# Altium schematic sheet dental-uint-chair_control v1_1.SchDoc
size 840 x 594 mm
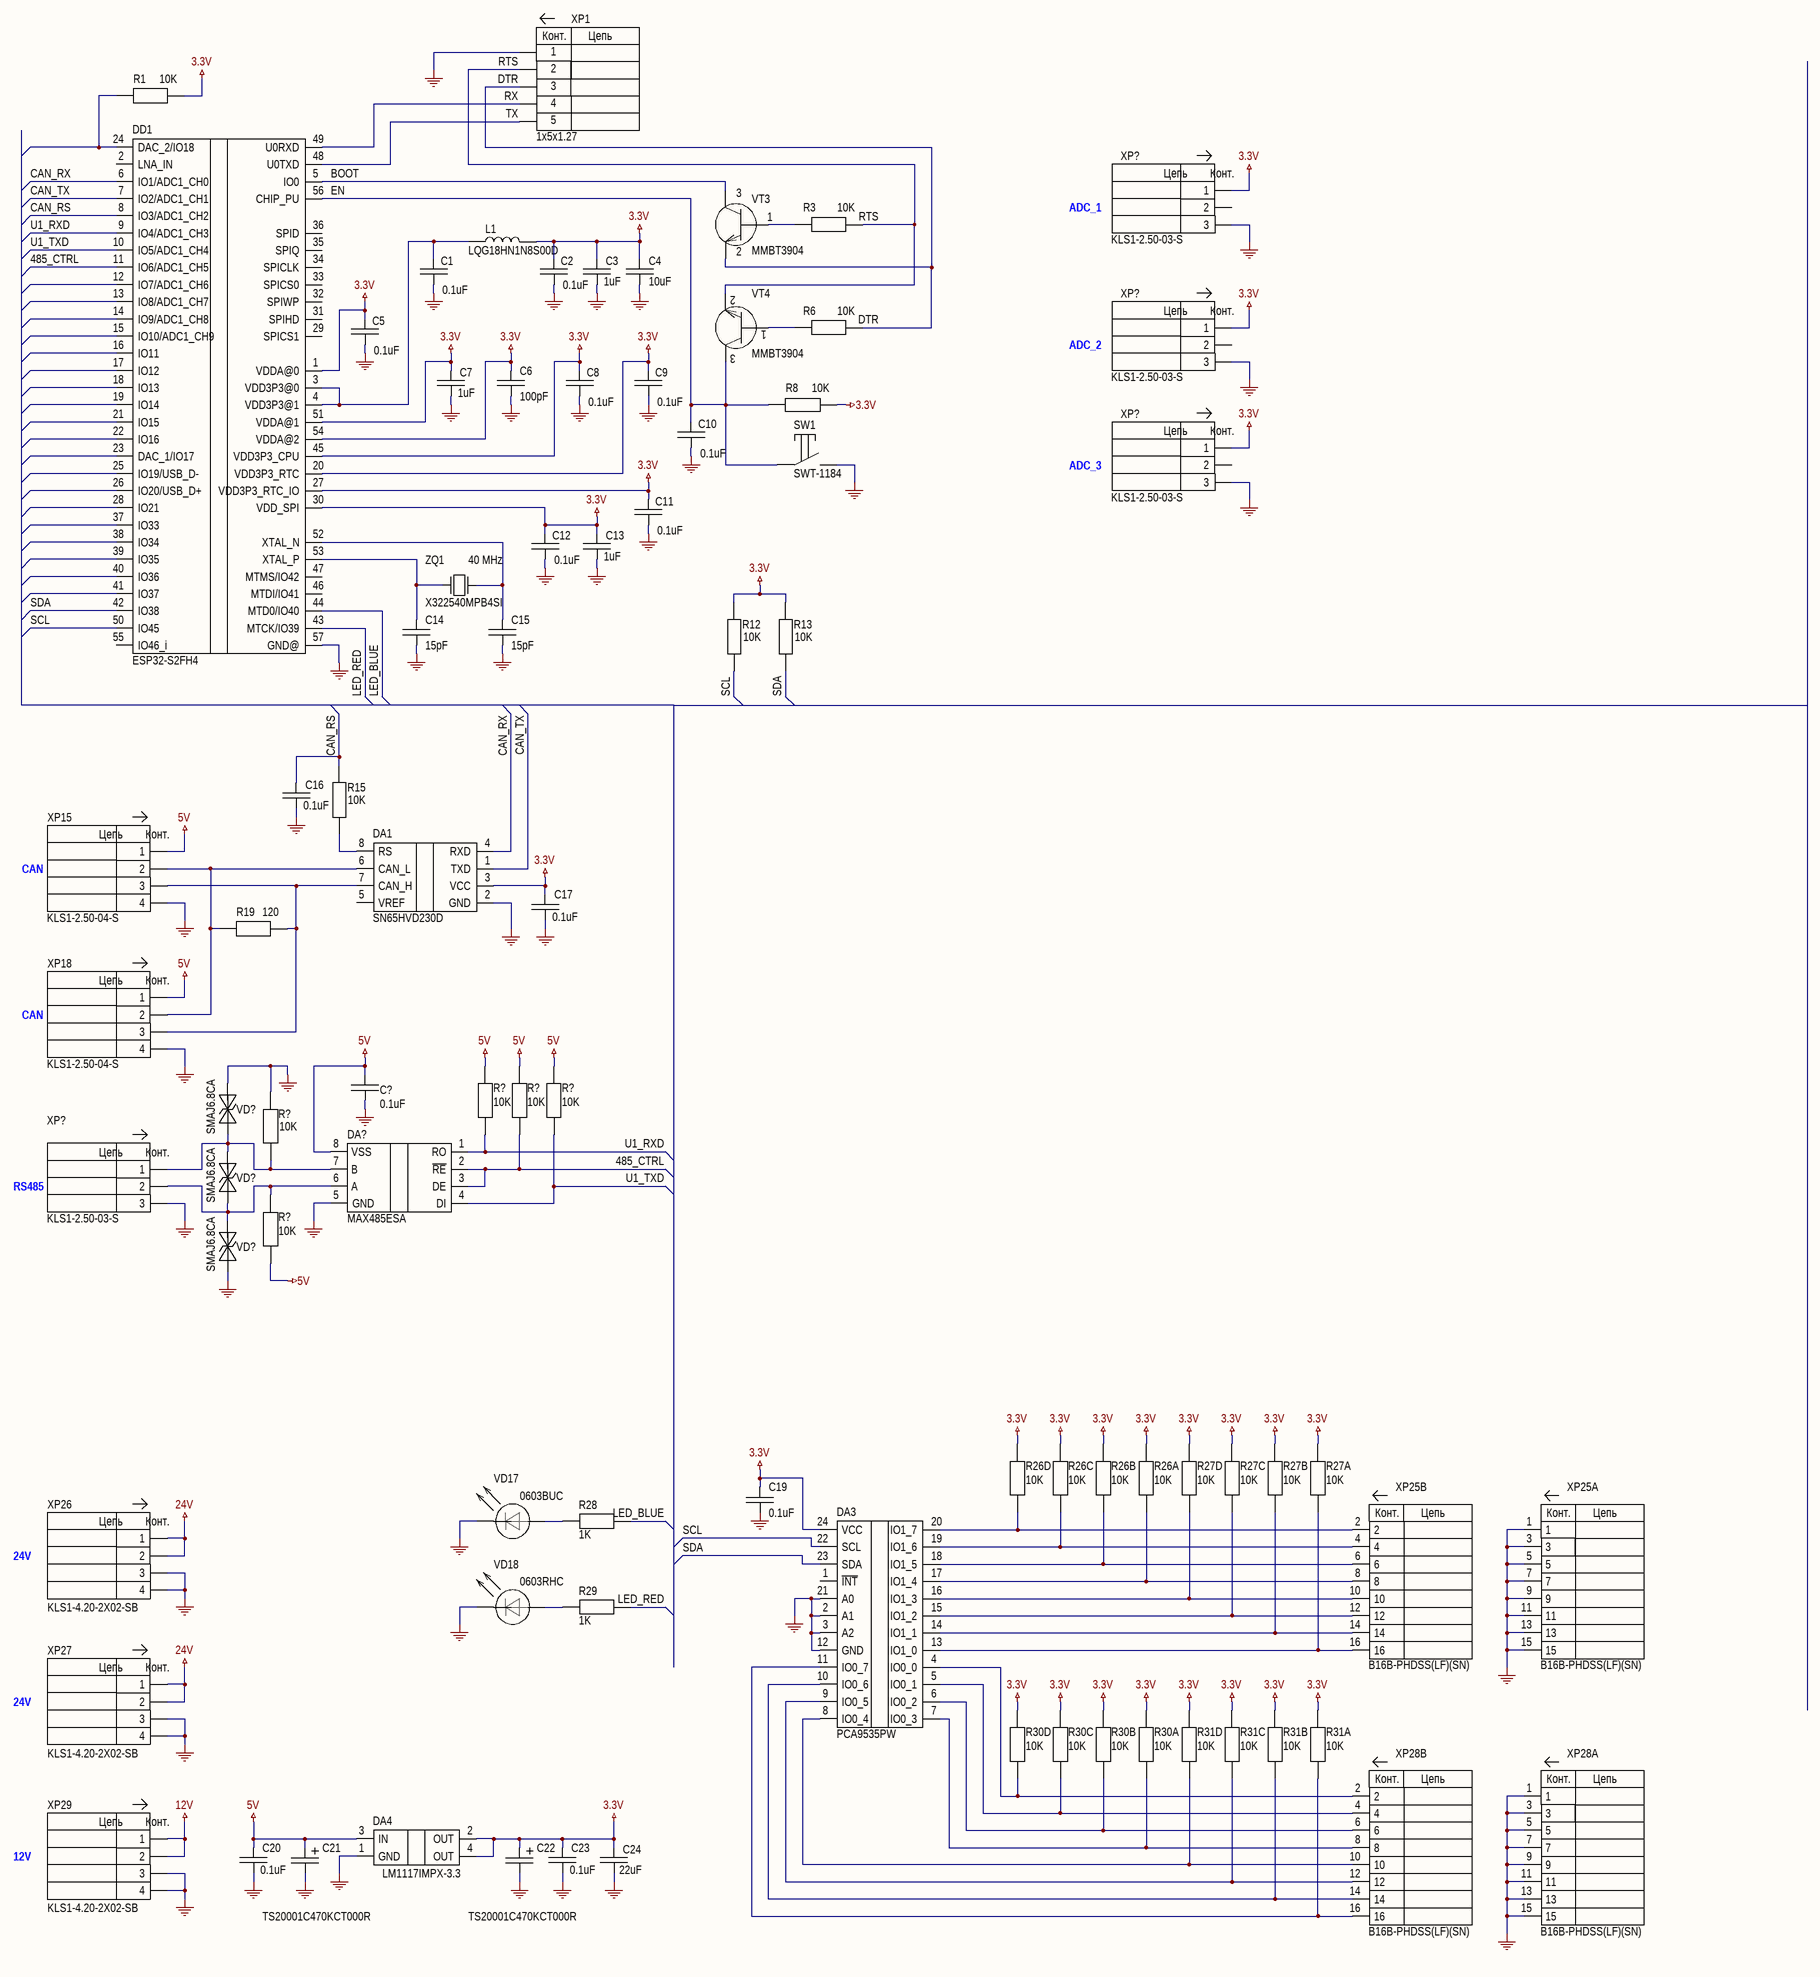
[diagram p0: dental-uint-chair_control v1_1.SchDoc]

## Parts
(Parts that share a designator on the sheet are numbered #1, #2 ... from top to bottom, then left to right.)
C1  value 0.1uF  [CC_0603]  (hidden comment: CC0603KRX7R5BB104)
C2  value 0.1uF  [CC_0603]  (hidden comment: CC0603KRX7R5BB104)
C3  value 1uF  [CC_0603]  (hidden comment: CL10A105KB8NNNC)
C4  value 10uF  [CC_0603]  (hidden comment: CL10A106KP8NNNC)
C5  value 0.1uF  [CC_0603]  (hidden comment: CC0603KRX7R5BB104)
C6  value 100pF  [CC_0603]  (hidden comment: CC0603FRNPO9BN101)
C7  value 1uF  [CC_0603]  (hidden comment: CL10A105KB8NNNC)
C8  value 0.1uF  [CC_0603]  (hidden comment: CC0603KRX7R5BB104)
C9  value 0.1uF  [CC_0603]  (hidden comment: CC0603KRX7R5BB104)
C10  value 0.1uF  [CC_0603]  (hidden comment: CC0603KRX7R5BB104)
C11  value 0.1uF  [CC_0603]  (hidden comment: CC0603KRX7R5BB104)
C12  value 0.1uF  [CC_0603]  (hidden comment: CC0603KRX7R5BB104)
C13  value 1uF  [CC_0603]  (hidden comment: CL10A105KB8NNNC)
C14  value 15pF  [CC_0603]  (hidden comment: CC0603GPNPO9BN150)
C15  value 15pF  [CC_0603]  (hidden comment: CC0603GPNPO9BN150)
C16  value 0.1uF  [CC_0603]  (hidden comment: CC0603KRX7R5BB104)
C17  value 0.1uF  [CC_0603]  (hidden comment: CC0603KRX7R5BB104)
C19  value 0.1uF  [CC_0603]  (hidden comment: CC0603KRX7R5BB104)
C20  value 0.1uF  [CC_0603]  (hidden comment: CC0603KRX7R5BB104)
C21  TS20001C470KCT000R  [CC_TANT_C]
C22  TS20001C470KCT000R  [CC_TANT_C]
C23  value 0.1uF  [CC_0603]  (hidden comment: CC0603KRX7R5BB104)
C24  value 22uF  [CC_0805]  (hidden comment: GRM21BR60J226ME39L)
C?  value 0.1uF  [CC_0603]  (hidden comment: CC0603KRX7R5BB104)
DA1  SN65HVD230D  [SOIC-8]
DA3  PCA9535PW  [TSSOP-24]
DA4  LM1117IMPX-3.3  [SOT-223]
DA?  MAX485ESA  [SOIC-8]
DD1  ESP32-S2FH4  [QFN40P700X700X90-57T400N]
L1  LQG18HN1N8S00D  [IC_0603]
R1  value 10K  [RC_0603]  (hidden comment: AC0603FR-0710KL)
R3  value 10K  [RC_0603]  (hidden comment: AC0603FR-0710KL)
R6  value 10K  [RC_0603]  (hidden comment: AC0603FR-0710KL)
R8  value 10K  [RC_0603]  (hidden comment: AC0603FR-0710KL)
R12  value 10K  [RC_0603]  (hidden comment: AC0603FR-0710KL)
R13  value 10K  [RC_0603]  (hidden comment: AC0603FR-0710KL)
R15  value 10K  [RC_0603]  (hidden comment: AC0603FR-0710KL)
R19  value 120  [RC_0603]  (hidden comment: RC0603FR-07120RL)
R26  value 10K  [RC_0603x4]  (hidden comment: YC164-JR-0710KL)  (parts A,B,C,D of 4)
R27  value 10K  [RC_0603x4]  (hidden comment: YC164-JR-0710KL)  (parts A,B,C,D of 4)
R28  value 1K  [RC_0603]  (hidden comment: AC0603FR-071KL)
R29  value 1K  [RC_0603]  (hidden comment: AC0603FR-071KL)
R30  value 10K  [RC_0603x4]  (hidden comment: YC164-JR-0710KL)  (parts A,B,C,D of 4)
R31  value 10K  [RC_0603x4]  (hidden comment: YC164-JR-0710KL)  (parts A,B,C,D of 4)
R?#1  value 10K  [RC_0603]  (hidden comment: AC0603FR-0710KL)
R?#2  value 10K  [RC_0603]  (hidden comment: AC0603FR-0710KL)
R?#3  value 10K  [RC_0603]  (hidden comment: AC0603FR-0710KL)
R?#4  value 10K  [RC_0603]  (hidden comment: AC0603FR-0710KL)
R?#5  value 10K  [RC_0603]  (hidden comment: AC0603FR-0710KL)
SW1  SWT-1184  [IT-1184]
VD17  0603BUC  [LED_0603]
VD18  0603RHC  [LED_0603]
VD?#1  SMAJ6.8CA  [D_1005]
VD?#2  SMAJ6.8CA  [D_1005]
VD?#3  SMAJ6.8CA  [D_1005]
VT3  MMBT3904  [SOT-23-3]
VT4  MMBT3904  [SOT-23-3]
XP1  1x5x1.27  [XT_1x5x1.27_offset]
XP15  KLS1-2.50-04-S  name: CAN  [KLS1-2.50-04-S]
XP18  KLS1-2.50-04-S  name: CAN  [KLS1-2.50-04-S]
XP25  B16B-PHDSS(LF)(SN)  [B16B-PHDSS]  (parts A,B of 2)
XP26  KLS1-4.20-2X02-SB  name: 24V  [KLS1-4.20-2X02-SB]
XP27  KLS1-4.20-2X02-SB  name: 24V  [KLS1-4.20-2X02-SB]
XP28  B16B-PHDSS(LF)(SN)  [B16B-PHDSS]  (parts A,B of 2)
XP29  KLS1-4.20-2X02-SB  name: 12V  [KLS1-4.20-2X02-SB]
XP?#1  KLS1-2.50-03-S  name: ADC_1  [KLS1-2.50-03-S]
XP?#2  KLS1-2.50-03-S  name: ADC_2  [KLS1-2.50-03-S]
XP?#3  KLS1-2.50-03-S  name: ADC_3  [KLS1-2.50-03-S]
XP?#4  KLS1-2.50-03-S  name: RS485  [KLS1-2.50-03-S]
ZQ1  X322540MPB4SI  value 40 MHz  [OSC: 3225]

## Nets
3.3V: C2.2 C3.2 C4.2 C5.2 C6.2 C7.2 C8.2 C9.2 C11.2 C12.2 C13.2 C17.2 C19.2 C22.1 C23.2 C24.2 DA1.3(VCC) DA3.24(VCC) DA4.2(OUT) DA4.4(OUT) DD1.1(VDDA@0) DD1.20(VDD3P3_RTC) DD1.27(VDD3P3_RTC_IO) DD1.30(VDD_SPI) DD1.45(VDD3P3_CPU) DD1.51(VDDA@1) DD1.54(VDDA@2) L1.2 R1.2 R8.2 R12.2 R13.2 R26.5 R26.6 R26.7 R26.8 R27.5 R27.6 R27.7 R27.8 R30.5 R30.6 R30.7 R30.8 R31.5 R31.6 R31.7 R31.8 XP?#1.1 XP?#2.1 XP?#3.1
5V: C20.2 C21.1 C?.2 DA4.3(IN) DA?.8(VSS) R?#1.2 R?#2.2 R?#3.2 R?#5.1 XP15.1 XP18.1
12V: XP29.1 XP29.2
24V: XP26.1 XP26.2 XP27.1 XP27.2
GND: C1.1 C2.1 C3.1 C4.1 C5.1 C6.1 C7.1 C8.1 C9.1 C10.1 C11.1 C12.1 C13.1 C14.1 C15.1 C16.1 C17.1 C19.1 C20.1 C21.2 C22.2 C23.1 C24.1 C?.1 DA1.2(GND) DA3.2(A1) DA3.3(A2) DA3.12(GND) DA3.21(A0) DA4.1(GND) DA?.5(GND) DD1.57(GND@) R?#4.2 SW1.2 VD17.2(C) VD18.2(C) VD?#1.2(C) VD?#3.1(A) XP1.1 XP15.4 XP18.4 XP25.1 XP25.3 XP25.5 XP25.7 XP25.9 XP25.11 XP25.13 XP25.15 XP26.3 XP26.4 XP27.3 XP27.4 XP28.1 XP28.3 XP28.5 XP28.7 XP28.9 XP28.11 XP28.13 XP28.15 XP29.3 XP29.4 XP?#1.3 XP?#2.3 XP?#3.3 XP?#4.3
485_CTRL: DA?.2(~{RE}) DA?.3(DE) DD1.11(IO6/ADC1_CH5) R?#2.1
BOOT: DD1.5(IO0) VT3.3(C)
CAN_RS: C16.2 DD1.8(IO3/ADC1_CH2) R15.2
CAN_RX: DA1.4(RXD) DD1.6(IO1/ADC1_CH0)
CAN_TX: DA1.1(TXD) DD1.7(IO2/ADC1_CH1)
DTR: R6.2 VT3.2(E) XP1.3
EN: C10.2 DD1.56(CHIP_PU) R8.1 SW1.1 VT4.3(C)
LED_BLUE: DD1.44(MTD0/IO40) R28.1
LED_RED: DD1.43(MTCK/IO39) R29.1
RTS: R3.2 VT4.2(E) XP1.2
RX: DD1.49(U0RXD) XP1.4
SCL: DA3.22(SCL) DD1.50(IO45) R12.1
SDA: DA3.23(SDA) DD1.42(IO38) R13.1
TX: DD1.48(U0TXD) XP1.5
U1_RXD: DA?.1(RO) DD1.9(IO4/ADC1_CH3) R?#1.1
U1_TXD: DA?.4(DI) DD1.10(IO5/ADC1_CH4) R?#3.1
NetC1_2: C1.2 DD1.3(VDD3P3@0) DD1.4(VDD3P3@1) L1.1
NetC14_2: C14.2 DD1.53(XTAL_P) ZQ1.1
NetC15_2: C15.2 DD1.52(XTAL_N) ZQ1.3
NetDA1_6: DA1.6(CAN_L) R19.2 XP15.2 XP18.2
NetDA1_7: DA1.7(CAN_H) R19.1 XP15.3 XP18.3
NetDA1_8: DA1.8(RS) R15.1
NetDA3_4: DA3.4(IO0_0) R30.4 XP28.2
NetDA3_5: DA3.5(IO0_1) R30.3 XP28.4
NetDA3_6: DA3.6(IO0_2) R30.2 XP28.6
NetDA3_7: DA3.7(IO0_3) R30.1 XP28.8
NetDA3_8: DA3.8(IO0_4) R31.4 XP28.10
NetDA3_9: DA3.9(IO0_5) R31.3 XP28.12
NetDA3_10: DA3.10(IO0_6) R31.2 XP28.14
NetDA3_11: DA3.11(IO0_7) R31.1 XP28.16
NetDA3_13: DA3.13(IO1_0) R27.1 XP25.16
NetDA3_14: DA3.14(IO1_1) R27.2 XP25.14
NetDA3_15: DA3.15(IO1_2) R27.3 XP25.12
NetDA3_16: DA3.16(IO1_3) R27.4 XP25.10
NetDA3_17: DA3.17(IO1_4) R26.1 XP25.8
NetDA3_18: DA3.18(IO1_5) R26.2 XP25.6
NetDA3_19: DA3.19(IO1_6) R26.3 XP25.4
NetDA3_20: DA3.20(IO1_7) R26.4 XP25.2
NetDA?_6: DA?.6(A) R?#5.2 VD?#2.1(A) VD?#3.2(C) XP?#4.2
NetDA?_7: DA?.7(B) R?#4.1 VD?#1.1(A) VD?#2.2(C) XP?#4.1
NetDD1_24: DD1.24(DAC_2/IO18) R1.1
NetR3_1: R3.1 VT3.1(B)
NetR6_1: R6.1 VT4.1(B)
NetR28_2: R28.2 VD17.1(A)
NetR29_2: R29.2 VD18.1(A)

Not connected (* = marked no-connect by the designer): DA1 5(VREF); DA3 1(~{INT}); DD1 2(LNA_IN) 12(IO7/ADC1_CH6) 13(IO8/ADC1_CH7) 14(IO9/ADC1_CH8) 15(IO10/ADC1_CH9) 16(IO11) 17(IO12) 18(IO13) 19(IO14) 21(IO15) 22(IO16) 23(DAC_1/IO17) 25(IO19/USB_D-) 26(IO20/USB_D+) 28(IO21) 29(SPICS1) 31(SPIHD) 32(SPIWP) 33(SPICS0) 34(SPICLK) 35(SPIQ) 36(SPID) 37(IO33) 38(IO34) 39(IO35) 40(IO36) 41(IO37) 46(MTDI/IO41) 47(MTMS/IO42) 55(IO46_i); XP?#1 2; XP?#2 2; XP?#3 2; ZQ1 2 4

## Notes on the sheet
- Перв. примен.
- Справ. №
- Подп. и дата
- Инв. № дубл.
- Взам. инв. №
- Разраб.
- Изм.
- Лист
- № докум.
- Подп.
- Дата
- Лит.
- Масса
- Масштаб
- Пров.
- Т.контр.
- Листов
- Инв. № подл.
- Утв.
- Н.контр.
- 2.106-A1
- Копировал
- Формат А1
- (in symbol B16B-PHDSS(LF)(SN), part A) Конт.; Цепь
- (in symbol B16B-PHDSS(LF)(SN), part B) Конт.; Цепь
- (in symbol KLS1-2.50-03-x) Цепь; Конт.
- (in symbol KLS1-2.50-04-x) Цепь; Конт.
- (in symbol KLS1-4.20-2X02-x) Цепь; Конт.
- (in symbol XT_1x5x1_27) Конт.; Цепь

## Library data of the parts
C1 C2 C5 C8-C12 C16 C17 C19 C20 C23 C? = C: Cap Ceramic, 0603, 0.1u, 10%, 16V, X7R (Yageo); type: CC0603KRX7R5BB104
C3 C7 C13 = C: Cap Ceramic, 0603, 1u, 10%, 50V, X5R (Sumsung); type: CL10A105KB8NNNC
C4 = C: Cap Ceramic, 0603, 10u, 10%, 16V, X5R (Sumsung); type: CL10A106KP8NNNC
C6 = C: Cap Ceramic, 0603, 100p, 1%, 50V, NP0 (Yageo); type: CC0603FRNPO9BN101
C14 C15 = C: Cap Ceramic, 0603, 15pF, 50V, NP0 (Yageo); type: CC0603GPNPO9BN150
C21 C22 = C_polar: 47uF, 16v, C, 10%, @SUNTAN,; value: 47uF; type: TS20001C470KCT000R
C24 = C: Cap Ceramic, 0805, 22u, 20%, 6.3V, X5R, -55 +85C (Murata); type: GRM21BR60J226ME39L
DA1 = SN65HVD230D: 3.3-V CAN TRANSCEIVERS, @TI; type: SN65HVD230D; ComponentLink1Description: link; ComponentLink1URL: https://www.elitan.ru/pdf/0/1/8/5/1/01851789.pdf
DA3 = PCA9535PW: I2C I/O EXPANDER; type: PCA9554ARGTR
DA4 = LM1117IMPX-3.3: LDO, 3.3v, 0.8A, SOT-223, Texas Instruments; type: LM1117S-3.3
DA? = MAX485ESA: RS-485/RS-422 Transceivers, @AD; type: MAX485ESA; ComponentLink1Description: link; ComponentLink1URL: https://www.elitan.ru/pdf/0/1/5/4/6/01546523.pdf
DD1 = ESP32-S2: SMD WI-FI IC, ESP32-S2FH4, SINGAL-C; MF: Espressif Systems; Value: ESP32-S2; Package: None; Price: None; MP: ESP32-S2; Availability: Unavailable; SnapEDA_Link: https://www.snapeda.com/parts/ESP32-S2/Espressif%20Systems/view-part/4571535/?ref=snap; ComponentLink1Description: link; ComponentLink1URL: https://www.espressif.com/sites/default/files/documentation/esp32-s2_datasheet_en.pdf
L1 = L: 1.1A, 1.8nH,100mΩ, 0603, Inductors (SMD), @MURATA; type: 0603; value: LQG18HN1N8S00D
R1 R3 R6 R8 R12 R13 R15 R?#1-R?#5 = R: Res, 0603, 10K, 1%, 0.25W (ф. Yageo); type: AC0603FR-0710KL; power: 0.25W
R19 = R: Res, 0603, 120, 1%, 0.25W (ф. Yageo); type: RC0603FR-07120RL; power: 0.25W
R26 R27 R30 R31 = R_Array: Res, 0603x4, 10K, 5%, 0.25W (ф. Yageo); type: YC164-JR-0710KL; power: 0.25W
R28 R29 = R: Res, 0603, 1K 1%, 0.25W (ф. Yageo); type: AC0603FR-071KL; power: 0.25W
SW1 = smd-side-push-button
VD17 = LED: Led, 0603, BLUE, 20mA, 125, 140MCD, CPMELEC
VD18 = LED: Led, 0603, RED, 20mA, 125, 140MCD, CPMELEC
VD?#1-VD?#3 = D_TVS: 39A, 400W, 6.8V, DO-214AC(SMA), TVS@KLSEL; type: SMAJ6.8CA
VT3 VT4 = N-P-N-SOT-23: type: MMBT3904
XP1 = XT_1x5x1_27: type: 1x5x1.27
XP15 XP18 = KLS1-2.50-04-x: 2.5mm, 4pin, KLS; ComponentLink1Description: link; ComponentLink1URL: https://www.triatron.ru/upload/catalog_photo/elements/pdf/212764.pdf
XP26 XP27 XP29 = KLS1-4.20-2X02-x: 4.2mm, 4pin, KLS; ComponentLink1Description: link; ComponentLink1URL: https://www.elitan.ru/pdf/1/1/8/6/4/11864968.pdf
XP?#1-XP?#4 = KLS1-2.50-03-x: 2.5mm, 3pin, KLS; ComponentLink1Description: link; ComponentLink1URL: https://www.triatron.ru/upload/catalog_photo/elements/pdf/212764.pdf
ZQ1 = OSC 3225: 40MHz, 15pF, ±10ppm, SMD3225-4P, Crystals ROHS, @YXC; type: X322540MPB4SI
XP25 XP28 = B16B-PHDSS(LF)(SN): type: B16B-PHDSS(LF)(SN)